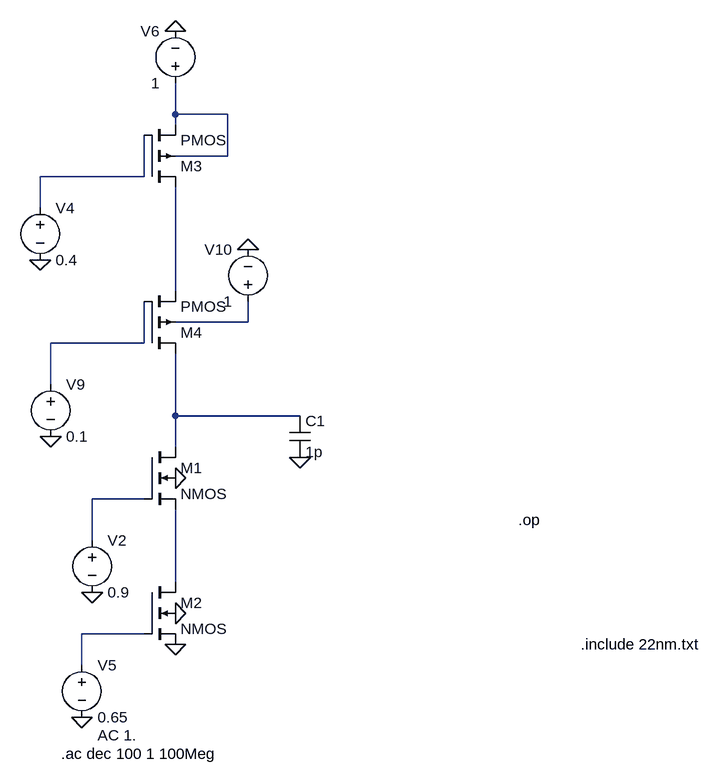
[diagram p0: schematic AKSHAT_22nm.asc]
AKSHAT_22nm.asc, the LTspice schematic file:
Version 4
SHEET 1 880 680
WIRE -80 -592 -80 -640
WIRE 0 -592 -80 -592
WIRE -80 -576 -80 -592
WIRE 0 -528 0 -592
WIRE 0 -528 -80 -528
WIRE -128 -496 -128 -560
WIRE -128 -496 -288 -496
WIRE -288 -448 -288 -496
WIRE -80 -320 -80 -480
WIRE 32 -272 32 -304
WIRE 32 -272 -80 -272
WIRE -128 -240 -128 -304
WIRE -128 -240 -272 -240
WIRE -272 -176 -272 -240
WIRE -80 -128 -80 -224
WIRE 112 -128 -80 -128
WIRE -80 -80 -80 -128
WIRE -128 0 -208 0
WIRE -208 64 -208 0
WIRE -80 128 -80 16
WIRE -128 208 -224 208
WIRE -224 256 -224 208
FLAG -80 224 0
FLAG -80 176 0
FLAG -224 336 0
FLAG -208 144 0
FLAG -80 -32 0
FLAG 32 -384 0
FLAG -272 -96 0
FLAG -288 -368 0
FLAG -80 -720 0
FLAG 112 -64 0
DATAFLAG -80 -368 ""
DATAFLAG -80 -144 ""
DATAFLAG -80 80 ""
SYMBOL nmos4 -128 -80 R0
SYMATTR InstName M1
SYMATTR Value2 l=0.044u w=3.040427u
SYMBOL nmos4 -128 128 R0
SYMATTR InstName M2
SYMATTR Value2 l=0.044u w=1.76u
SYMBOL voltage -208 48 R0
WINDOW 123 0 0 Left 0
WINDOW 39 0 0 Left 0
SYMATTR InstName V2
SYMATTR Value 0.9
SYMBOL voltage -224 240 R0
WINDOW 123 24 124 Left 2
WINDOW 39 0 0 Left 0
SYMATTR Value2 AC 1.
SYMATTR InstName V5
SYMATTR Value 0.65
SYMBOL voltage -288 -464 R0
WINDOW 123 0 0 Left 0
WINDOW 39 0 0 Left 0
SYMATTR InstName V4
SYMATTR Value 0.4
SYMBOL voltage -80 -624 R180
WINDOW 0 24 96 Left 2
WINDOW 3 24 16 Left 2
WINDOW 123 0 0 Left 0
WINDOW 39 0 0 Left 0
SYMATTR InstName V6
SYMATTR Value 1
SYMBOL voltage -272 -192 R0
WINDOW 123 0 0 Left 0
WINDOW 39 0 0 Left 0
SYMATTR InstName V9
SYMATTR Value 0.1
SYMBOL voltage 32 -288 R180
WINDOW 0 24 96 Left 2
WINDOW 3 24 16 Left 2
WINDOW 123 0 0 Left 0
WINDOW 39 0 0 Left 0
SYMATTR InstName V10
SYMATTR Value 1
SYMBOL pmos4 -128 -224 M180
SYMATTR InstName M4
SYMATTR Value2 l=0.044u w=7.9249865u
SYMBOL pmos4 -128 -480 M180
SYMATTR InstName M3
SYMATTR Value2 l=0.044u w=7.930969u
SYMBOL cap 96 -128 R0
SYMATTR InstName C1
SYMATTR Value 1p
TEXT 544 224 Left 2 !.include 22nm.txt
TEXT -256 392 Left 2 !.ac dec 100 1 100Meg
TEXT 448 32 Left 2 !.op

The netlist it stands for:
* AKSHAT_22nm.asc
M1 N006 N007 N008 0 NMOS l=0.044u w=3.040427u
M2 N008 N009 0 0 NMOS l=0.044u w=1.76u
V2 N007 0 0.9
V5 N009 0 0.65 AC 1.
V4 N002 0 0.4
V6 N001 0 1
V9 N005 0 0.1
V10 N004 0 1
M4 N006 N005 N003 N004 PMOS l=0.044u w=7.9249865u
M3 N003 N002 N001 N001 PMOS l=0.044u w=7.930969u
C1 N006 0 1p
.model NMOS NMOS
.model PMOS PMOS
.lib standard.mos
.include 22nm.txt
.ac dec 100 1 100Meg
.op
.backanno
.end